# EAGLE design 8channel (EAGLE 9.5.1)
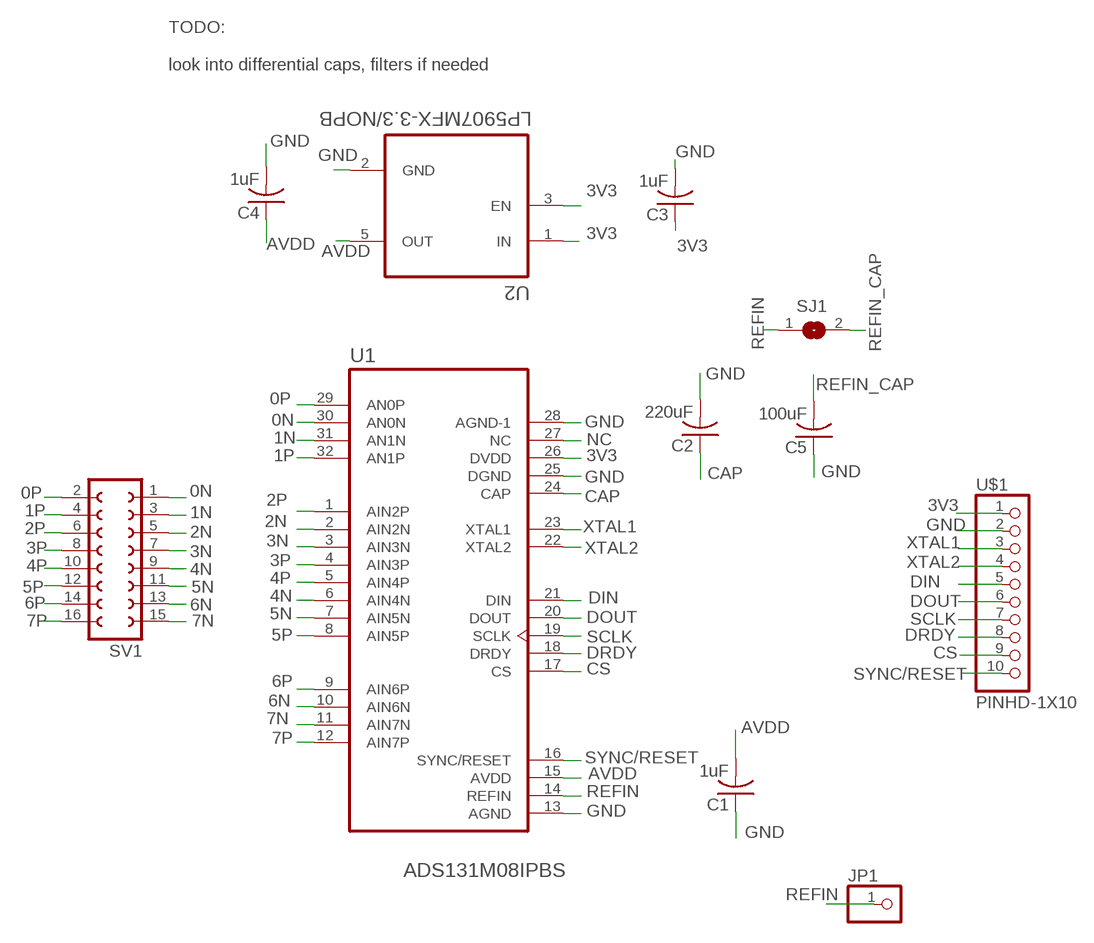
[diagram p0: schematic, sheet 1]

## Parts
C1  1uF  C-USC0603  [C0603]
C2  220uF  C-USC0603  [C0603]
C3  1uF  C-USC0603  [C0603]
C4  1uF  C-USC0603  [C0603]
C5  100uF  C-USC0603  [C0603]
JP1  PINHD-1X1  [1X01]
SJ1  SJ  [SJ]
SV1  FE08-2  [FE08-2]
U1  ADS131M08IPBS  [QFP50P700X700X120-32N]
U2  LP5907MFX-3.3/NOPB  [SOT95P280X145-5N]
U$1  PINHD-1X10  [1X10-BIG]

## Nets
0N: SV1.1 U1.30(AN0N)
0P: SV1.2 U1.29(AN0P)
1N: SV1.3 U1.31(AN1N)
1P: SV1.4 U1.32(AN1P)
2N: SV1.5 U1.2(AIN2N)
2P: SV1.6 U1.1(AIN2P)
3N: SV1.7 U1.3(AIN3N)
3P: SV1.8 U1.4(AIN3P)
3V3: C3.1 U1.26(DVDD) U2.1(IN) U2.3(EN) U$1.1
4N: SV1.9 U1.6(AIN4N)
4P: SV1.10 U1.5(AIN4P)
5N: SV1.11 U1.7(AIN5N)
5P: SV1.12 U1.8(AIN5P)
6N: SV1.13 U1.10(AIN6N)
6P: SV1.14 U1.9(AIN6P)
7N: SV1.15 U1.11(AIN7N)
7P: SV1.16 U1.12(AIN7P)
AVDD: C1.2 C4.1 U1.15(AVDD) U2.5(OUT)
CAP: C2.1 U1.24(CAP)
CS: U1.17(CS) U$1.9
DIN: U1.21(DIN) U$1.5
DOUT: U1.20(DOUT) U$1.6
DRDY: U1.18(DRDY) U$1.8
GND: C1.1 C2.2 C3.2 C4.2 C5.1 U1.13(AGND) U1.25(DGND) U1.28(AGND-1) U2.2(GND) U$1.2
NC: U1.27(NC)
REFIN: JP1.1 SJ1.1 U1.14(REFIN)
REFIN_CAP: C5.2 SJ1.2
SCLK: U1.19(SCLK) U$1.7
SYNC/RESET: U1.16(SYNC/RESET) U$1.10
XTAL1: U1.23(XTAL1) U$1.3
XTAL2: U1.22(XTAL2) U$1.4

## Notes on the sheet
- TODO:
  
  look into differential caps, filters if needed

## Library data of the parts
C1-C5 = adafruit:C-US: CAPACITOR, American symbol
JP1 = adafruit:PINHD-1X1: Pin header 1x1 for 0.1" spacing With round pins
SJ1 = jumper:SJ: SMD solder JUMPER
SV1 = con-lsta:FE08-2: FEMALE HEADER; OC_FARNELL: unknown; OC_NEWARK: unknown
U1 = ADS131M08IPBS:ADS131M08IPBS: None Check prices <https://pricing.snapeda.com/parts/ADS131M08IPBS/Texas%20Instruments/view-part?ref=eda>; AVAILABILITY: Warning; DESCRIPTION: 24-bit 32-kSPS 8-channelsimultaneous-sampling delta-sigma ADC 32-TQFP -40 to 125; MF: Texas Instruments; MP: ADS131M08IPBS; PACKAGE: TQFP-32 Texas Instruments; PRICE: None; PURCHASE-URL: https://pricing.snapeda.com/search/part/ADS131M08IPBS/?ref=eda
U2 = LP5907MFX-3.3_NOPB:LP5907MFX-3.3/NOPB: IC REG LINEAR 3.3V 250MA SOT23; AVAILABILITY: Unavailable; DESCRIPTION: Linear Voltage Regulator IC 1 Output 250mA SOT-23-5; MF: Texas Instruments; MP: LP5907MFX-3.3/NOPB; PACKAGE: SOT-23 Texas Instruments; PRICE: None
U$1 = adafruit:PINHD-1X10: Pin header 1x10 0.1" spacing With round pins

## Board
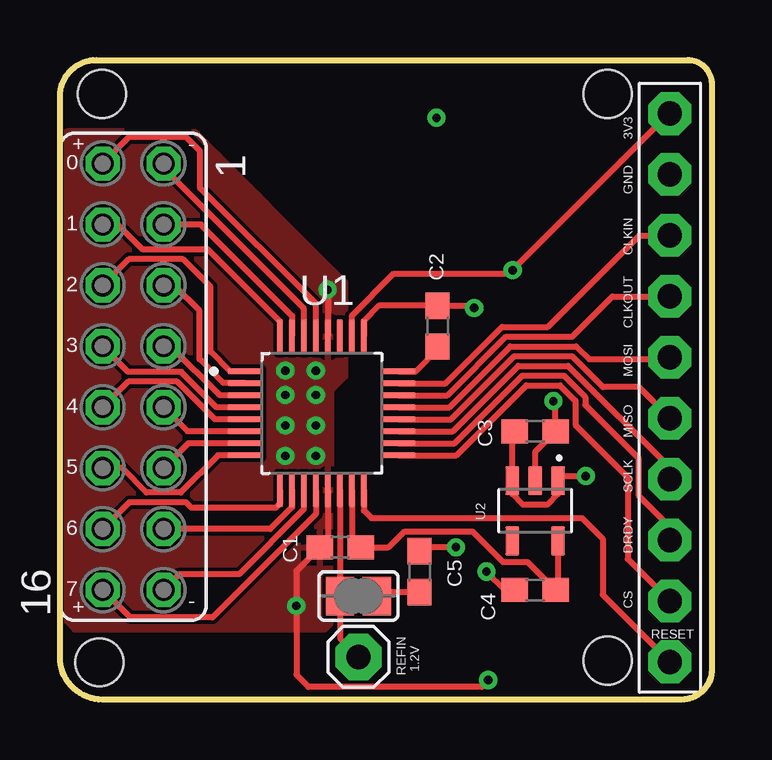
[diagram p1: board, top side]
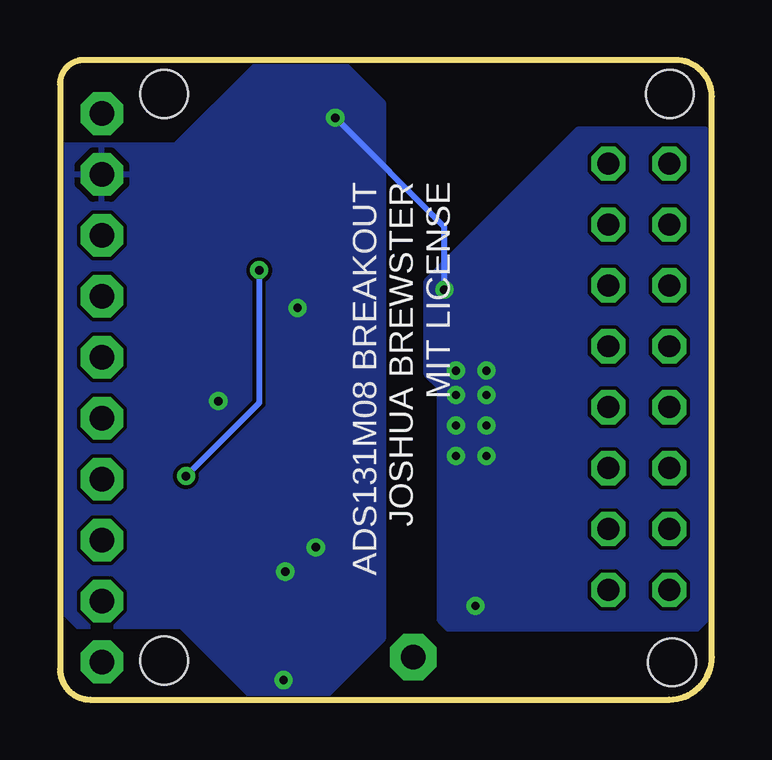
[diagram p2: board, bottom side, seen from below]

Size 27.18 x 26.67 mm. Coordinates in mm from the lower left corner, seen from the top.
Outline: 25.91,0 1.78,0 arc-90 0,1.78 0,25.15 arc-90 1.52,26.67 26.16,26.67 arc-90 27.18,25.65 27.18,1.27 arc-90 25.91,0
Copper layers (1*16): Top 0.035mm / dielectric 1.5mm / Bottom 0.035mm
Design rules "default *": minimum track width 6mil, minimum drill 0.35mm, track to track 6mil, track to pad 6mil, pad to pad 6mil, via to via 6mil, smd to smd 6mil, copper to edge 1mil, drill to drill 6mil, minimum pad ring 10mil, minimum via ring 8mil, stop-mask expansion 4mil, vias tented up to drill 0mil, thermal gap 10mil
Holes 2 mm at 1.65,1.55 1.75,25.25 22.83,25.25 22.83,1.63

### Footprints (pad centres in the part's own frame; a part is rotated, then mirrored left to right if it is on the bottom)
C0603 = smd 1.1 x 1: 1 -0.85,0; 2 0.85,0
1X01 = drill 1.016 pad 1.93 octagon: 1 0,0
SJ = smd 1.168 x 1.6: 1 -0.762,0; 2 0.762,0
FE08-2 = drill 0.914 octagon: 1 -8.89,1.27; 2 -8.89,-1.27; 3 -6.35,1.27; 4 -6.35,-1.27; 5 -3.81,1.27; 6 -3.81,-1.27; 7 -1.27,1.27; 8 -1.27,-1.27; 9 1.27,1.27; 10 1.27,-1.27; 11 3.81,1.27; 12 3.81,-1.27; 13 6.35,1.27; 14 6.35,-1.27; 15 8.89,1.27; 16 8.89,-1.27
QFP50P700X700X120-32N = smd 1.44 x 0.26: 1 -3.195,1.75; 2 -3.195,1.25; 3 -3.195,0.75; 4 -3.195,0.25; 5 -3.195,-0.25; 6 -3.195,-0.75; 7 -3.195,-1.25; 8 -3.195,-1.75; 17 3.195,-1.75; 18 3.195,-1.25; 19 3.195,-0.75; 20 3.195,-0.25; 21 3.195,0.25; 22 3.195,0.75; 23 3.195,1.25; 24 3.195,1.75 | smd 0.26 x 1.44: 9 -1.75,-3.195; 10 -1.25,-3.195; 11 -0.75,-3.195; 12 -0.25,-3.195; 13 0.25,-3.195; 14 0.75,-3.195; 15 1.25,-3.195; 16 1.75,-3.195; 25 1.75,3.195; 26 1.25,3.195; 27 0.75,3.195; 28 0.25,3.195; 29 -0.25,3.195; 30 -0.75,3.195; 31 -1.25,3.195; 32 -1.75,3.195
SOT95P280X145-5N = smd 1.21 x 0.59: 1 -1.255,0.95; 2 -1.255,0; 3 -1.255,-0.95; 4 1.255,-0.95; 5 1.255,0.95
1X10-BIG = drill 1.016 pad 1.778 octagon: 1 -11.43,0; 2 -8.89,0; 3 -6.35,0; 4 -3.81,0; 5 -1.27,0; 6 1.27,0; 7 3.81,0; 8 6.35,0; 9 8.89,0; 10 11.43,0

### Placement (x,y rotation side)
C1  11.68,6.35 0 top
C2  15.75,15.57 90 top
C3  19.81,11.18 0 top
C4  19.81,4.57 180 top
C5  14.99,5.33 270 top
JP1  12.45,1.78 0 top
SJ1  12.45,4.32 0 top
SV1  3.05,13.46 270 top
U1  10.92,11.94 0 top
U2  19.81,7.87 270 top
U$1  25.43,13 270 top

### Tracks (layer width: path | path; a pad name or v marks a point on that pad's centre or on a via)
0N
  Top 0.254: U1.30 10.17,16.3 4.32,22.16 SV1.1
0P
  Top 0.254: U1.29 10.67,16.51 5.84,21.34 5.84,22.86 5.26,23.44 2.87,23.44 SV1.2
1N
  Top 0.254: U1.31 9.67,15.18 9.68,15.2 9.68,16 5.87,19.81 SV1.3
1P
  Top 0.254: U1.32 9.17,15.77 6.17,18.77 3.45,18.77 2.41,19.81 SV1.4
2N
  Top 0.254: U1.2 7.71,13.2 6.81,13.2 5.82,14.2 5.82,16.22 4.76,17.27 SV1.5
2P
  Top 0.254: U1.1 7.09,13.69 6.27,14.51 6.27,17.22 5.13,18.36 2.87,18.36 SV1.6
3N
  Top 0.254: U1.3 6.67,12.69 4.62,14.73 SV1.7
3P
  Top 0.254: U1.4 6.54,12.19 5.06,13.66 2.84,13.66 SV1.8
3V3  (via drill 0.35)
  Top 0.254: C3.1 18.86,11.08 U2.3 18.86,8.57 19.3,8.13 20.32,8.13 20.76,8.57 U2.1 20.95,9.32 v21.92,9.32 | U1.26 12.16,15.14 12.16,16 13.92,17.76 18.72,17.76 v18.87,17.91 23.41,22.44 23.41,22.46 25.38,24.43 U$1.1
  Bottom 0.254: v18.87,17.91 18.87,12.37 v21.92,9.32
4N
  Top 0.254: U1.6 5.32,11.19 SV1.9
4P
  Top 0.254: U1.5 6.46,11.69 4.89,13.26 2.84,13.26 SV1.10
5N
  Top 0.254: U1.7 5.35,10.69 SV1.11
5P
  Top 0.254: U1.8 6.58,10.19 5.03,8.64 3.6,8.64 2.59,9.65 SV1.12
6N
  Top 0.254: U1.10 9.68,8.73 9.68,8.03 8.77,7.11 SV1.13
6P
  Top 0.254: U1.9 9.17,8.18 8.99,8 5.49,8 5.26,8.23 2.9,8.23 SV1.14
7N
  Top 0.254: U1.11 10.17,7.94 7.46,5.23 4.98,5.23 SV1.15
7P
  Top 0.254: U1.12 10.67,7.74 6.36,3.43 2.92,3.43 SV1.16
AVDD
  Top 0.254: U1.15 12.17,6.71 C1.2 13.71,6.35 14.37,7.01 17.2,7.01 18.48,5.73 19.5,5.73 C4.1 20.76,4.67 U2.5
CAP
  Top 0.254: U1.24 14.84,13.69 15.75,14.59 C2.1
CS
  Top 0.254: U1.17 16.53,10.19 19.44,13.1 20.85,13.1 21.49,12.46 21.49,11.45 23.67,9.27 23.67,5.86 U$1.9
DIN
  Top 0.254: U1.21 16.23,12.19 18.77,14.73 21.52,14.73 22.07,14.18 25.34,14.18 U$1.5
DOUT
  Top 0.254: U1.20 16.3,11.69 18.94,14.32 21.35,14.32 22.64,13.03 24.13,13.03 U$1.6
DRDY
  Top 0.254: U1.18 16.45,10.69 19.28,13.51 21.02,13.51 21.9,12.63 21.9,12.29 24.12,10.07 24.12,8.52 25.43,7.21 U$1.8
GND  (via drill 0.35)
  Top 0.254: v16.51,6.35 15.15,6.35 C5.1 | U1.25 12.67,15.79 13.3,16.42 C2.2 17.18,16.42 v17.27,16.33 | U2.2 19.81,10.33 C3.2 20.66,12.36 v20.57,12.45 | C4.2 18.54,4.57 v17.78,5.33 | U1.13 11.17,6.69 C1.1 9.86,5.37 v9.86,3.91 9.86,1.04 10.36,0.53 17.58,0.53 v17.86,0.81 | v11.15,17.09 11.17,17.07 U1.28
  Bottom 0.254: v11.15,17.09 11.15,19.71 v15.7,24.26
  other vias: 9.4,13.72 10.67,13.72 9.4,12.7 10.67,12.7 10.67,11.43 9.4,11.43 9.4,10.16 10.67,10.16
  pour Top: 0.61,2.92 11.05,2.92 11.33,3.2 11.33,12.9 11.91,13.49 11.91,17.37 5.59,23.7 0.3,23.7 -0.05,23.34 -0.05,3.58
  pour Bottom: 10.97,2.95 11.33,3.3 11.33,13 11.89,13.56 11.89,17.45 5.56,23.77 0.28,23.77 -0.08,23.42 -0.08,3.66 0.63,2.95
  pour Bottom: 27.18,23.11 22.35,23.11 19.05,26.42 15.24,26.42 13.72,24.89 13.72,2.54 16.26,0 19.05,0 22.1,3.05 26.42,3.05 27.18,3.81
REFIN
  Top 0.254: U1.14 11.68,8.73 SJ1.1 11.68,2.54 JP1.1
REFIN_CAP
  Top 0.254: SJ1.2 13.37,4.48 C5.2
SCLK
  Top 0.254: U1.19 16.38,11.19 19.11,13.92 21.18,13.92 25.43,9.67 U$1.7
SYNC/RESET
  Top 0.254: U1.16 12.67,7.88 12.98,7.57 21.77,7.57 22.63,6.71 22.63,4.37 U$1.10
XTAL1
  Top 0.254: U1.23 16.08,13.19 18.43,15.54 20.34,15.54 24.15,19.35 U$1.3
XTAL2
  Top 0.254: U1.22 16.16,12.69 18.6,15.14 21.36,15.14 23.04,16.81 U$1.4

### Text on the board
tNames: + | - | 3V3 | 0 | GND | 1 | CLKIN | 2 | CLKOUT | 3 | MOSI | 4 | MISO | 5 | SCLK | 6 | DRDY | 7 | - | CS | + | RESET | REFIN / 1.2V
bNames: ADS131M08 BREAKOUT / JOSHUA BREWSTER / MIT LICENSE